# Altium schematic sheet 海关全向控制器图传转接板V4.SchDoc
size A4
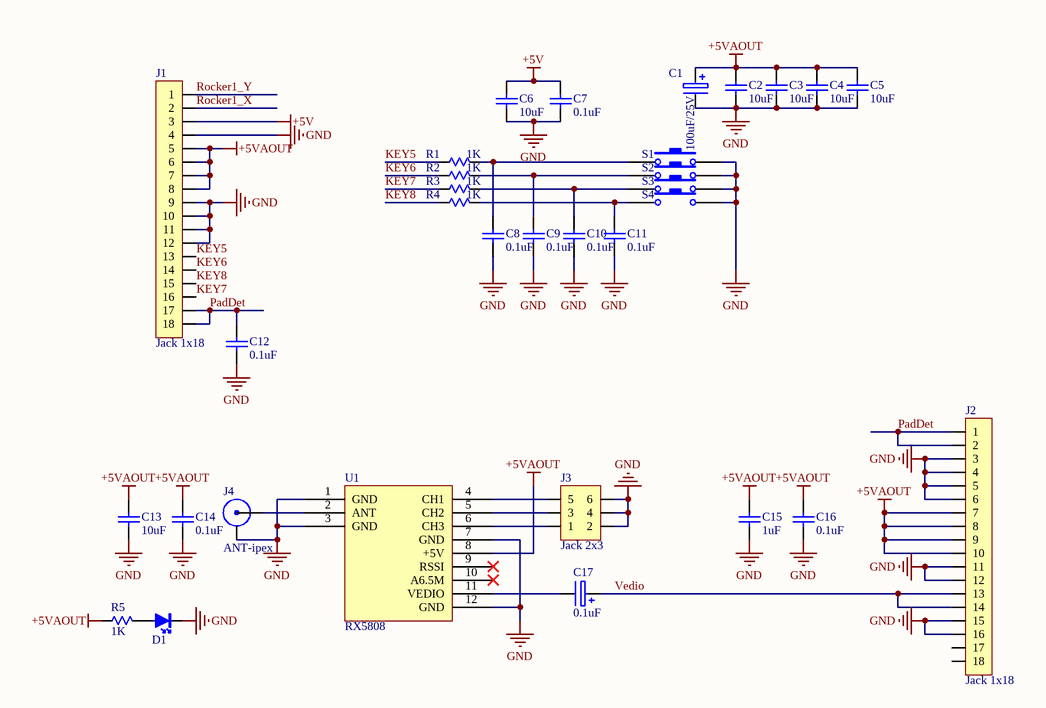
[diagram p0: 海关全向控制器图传转接板V4.SchDoc]

## Parts
C1  100uF/25V  [C7343]
C2  10uF  [C0805]
C3  10uF  [C0805]
C4  10uF  [C0805]
C5  10uF  [C0805]
C6  10uF  [C0805]
C7  0.1uF  [C0805]
C8  0.1uF  [C0805]
C9  0.1uF  [C0805]
C10  0.1uF  [C0805]
C11  0.1uF  [C0805]
C12  0.1uF  [C0805]
C13  10uF  [C0805]
C14  0.1uF  [C0805]
C15  1uF  [C0805]
C16  0.1uF  [C0805]
C17  0.1uF  [C10*10.8]
D1  LED  [LED0805]  (value not drawn)
J1  Jack 1x18  [0.5S-6X-18PB]
J2  Jack 1x18  [0.5S-6X-18PB]
J3  Jack 2x3  [A6S-3101-PH]
J4  ANT-ipex  [IPEX]
R1  1K  [R0805]
R2  1K  [R0805]
R3  1K  [R0805]
R4  1K  [R0805]
R5  1K  [R0805]
S1  SW-PB  [SW3X6X5]  (value not drawn)
S2  SW-PB  [SW3X6X5]  (value not drawn)
S3  SW-PB  [SW3X6X5]  (value not drawn)
S4  SW-PB  [SW3X6X5]  (value not drawn)
U1  RX5808  [RX5808]

## Nets
+5V: C6.2 C7.2 J1.3
+5VAOUT: C1.1 C2.2 C3.2 C4.2 C5.2 C13.2 C14.2 C15.2 C16.2 J1.5 J1.6 J1.7 J1.8 J2.7 J2.8 J2.9 J2.10 R5.1 U1.8(+5V)
GND: C1.2 C2.1 C3.1 C4.1 C5.1 C6.1 C7.1 C8.1 C9.1 C10.1 C11.1 C12.1 C13.1 C14.1 C15.1 C16.1 D1.2(K) J1.4 J1.9 J1.10 J1.11 J1.12 J2.3 J2.4 J2.5 J2.6 J2.11 J2.12 J2.15 J2.16 J3.2 J3.4 J3.6 J4.2(GND) S1.2 S2.2 S3.2 S4.2 U1.1(GND) U1.3(GND) U1.7(GND) U1.12(GND)
KEY5: J1.13 R1.1
KEY6: J1.14 R2.1
KEY7: J1.16 R3.1
KEY8: J1.15 R4.1
PadDet: C12.2 J1.17 J1.18 J2.1 J2.2
Rocker1_X: J1.2
Rocker1_Y: J1.1
Vedio: C17.1 J2.13 J2.14
NetC8_2: C8.2 R1.2 S1.1
NetC9_2: C9.2 R2.2 S2.1
NetC10_2: C10.2 R3.2 S3.1
NetC11_2: C11.2 R4.2 S4.1
NetC17_2: C17.2 U1.11(VEDIO)
NetD1_1: D1.1(A) R5.2
NetJ3_1: J3.1 U1.6(CH3)
NetJ3_3: J3.3 U1.5(CH2)
NetJ3_5: J3.5 U1.4(CH1)
NetJ4_1: J4.1(ANT) U1.2(ANT)

Not connected (* = marked no-connect by the designer): J2 17 18; U1 9(RSSI)* 10(A6.5M)*

## Library data of the parts
C1 C17 = Cap Poll
C2-C16 = Cap Semi
J1 J2 = Jack 1x18: 插座
J3 = Jack 2x3: 双排座
R1-R5 = Res: Resistor; Published: 8-Jun-2000; LatestRevisionDate: 04-Mar-2005; LatestRevisionNote: PCB Footprint replaced.; PackageReference: J1-0603; Publisher: Altium Limited
S1-S4 = SW-PB: Switch; Published: 24-Mar-1999; LatestRevisionDate: 17-Jul-2002; LatestRevisionNote: Re-released for DXP Platform.; PackageReference: SPST-2; Publisher: Altium Limited; PackageDescription: Switch; 2 Leads